# EAGLE design v1 (EAGLE 9.5.1)
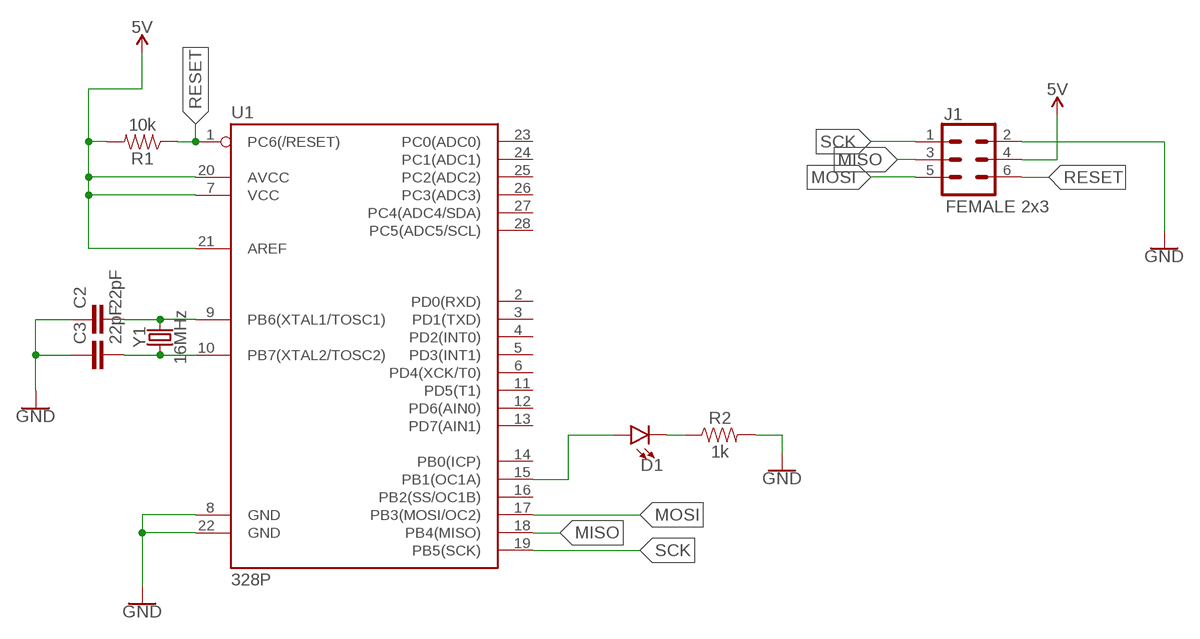
[diagram p0: schematic, sheet 1]

## Parts
C2  22pF  22PF-PTH-2.54MM-200V-5%  [CAP-PTH-2.54]
C3  22pF  22PF-PTH-2.54MM-200V-5%  [CAP-PTH-2.54]
D1  LED3MM  [LED_3MM]
J1  FEMALE 2x3  CONN_03X2FEMALE  [2X3]
R1  10k  1KOHM-HORIZ-1/4W-1%  [AXIAL-0.3]
R2  1k  1KOHM-HORIZ-1/4W-1%  [AXIAL-0.3]
U1  328P  ATMEGA328P_PDIP  [DIP28]
Y1  16MHz  CRYSTAL-16MHZPTH-HC49US  [HC49US]

## Nets
5V: J1.4 R1.P$2 U1.7(VCC) U1.20(AVCC) U1.21(AREF)
GND: C2.1 C3.1 J1.2 R2.P$2 U1.8(GND) U1.22(GND)
MISO: J1.3 U1.18(PB4(MISO))
MOSI: J1.5 U1.17(PB3(MOSI/OC2))
N$4: D1.A U1.15(PB1(OC1A))
N$5: D1.K(C) R2.P$1
N$6: C2.2 U1.9(PB6(XTAL1/TOSC1)) Y1.2
N$7: C3.2 U1.10(PB7(XTAL2/TOSC2)) Y1.1
RESET: J1.6 R1.P$1 U1.1(PC6(/RESET))
SCK: J1.1 U1.19(PB5(SCK))
Unconnected: U1.2(PD0(RXD)) U1.3(PD1(TXD)) U1.4(PD2(INT0)) U1.5(PD3(INT1)) U1.6(PD4(XCK/T0)) U1.11(PD5(T1)) U1.12(PD6(AIN0)) U1.13(PD7(AIN1)) U1.14(PB0(ICP)) U1.16(PB2(SS/OC1B)) U1.23(PC0(ADC0)) U1.24(PC1(ADC1)) U1.25(PC2(ADC2)) U1.26(PC3(ADC3)) U1.27(PC4(ADC4/SDA)) U1.28(PC5(ADC5/SCL))

## Library data of the parts
C2 C3 = SparkFun-Capacitors:22PF: 22pF ceramic capacitors A capacitor is a passive two-terminal electrical component used to store electrical energy temporarily in an electric field.; PROD_ID: CAP-09128
D1 = SparkFun-LED:LED: LED (Generic) Standard schematic elements and footprints for 5mm, 3mm, 1206, and 0603 sized LEDs. Generic LEDs with no color specified.; PROD_ID: DIO-08794
J1 = SparkFun-Connectors:CONN_03X2: Multi connection point. Often used as Generic Header-pin footprint for 0.1 inch spaced/style header connections You can populate with any combo of single row headers, but if you'd like an exact match, check these: Header - 2x3 (Male, 0.1") <https://www.sparkfun.com/products/12807> (PRT-12807) Header - 2x3 (Female, 0.1") <https://www.sparkfun.com/products/13010> (PRT-13010) 2x3 Pin Shrouded Header <https://www.sparkfun.com/products/10877> (PRT-10877) On any of the 0.1 inch spaced packages, you can populate with these: Break Away Headers - Straight <https://www.sparkfun.com/products/116> (PRT-00116) Break Away Male Headers - Right Angle <https://www.sparkfun.com/products/553> (PRT-00553) Female Headers <https://www.sparkfun.com/products/115> (PRT-00115) Break Away Headers - Machine Pin <https://www.sparkfun.com/products/117> (PRT-00117) Break Away Female Headers - Swiss Machine Pin <https://www.sparkfun.com/products/743> (PRT-00743) Special note: the shrouded connector mates well with our 3x2 ribbon cables: Ribbon Crimp Connector - 6-pin (2x3, Female) <https://www.sparkfun.com/products/10651> (PRT-10651) Ribbon Cable - 6 wire (15ft) <https://www.sparkfun.com/products/10646> (PRT-10646); PROD_ID: CONN-11566
R1 = SparkFun-Resistors:1KOHM: 1kΩ resistor A resistor is a passive two-terminal electrical component that implements electrical resistance as a circuit element. Resistors act to reduce current flow, and, at the same time, act to lower voltage levels within circuits. - Wikipedia; PROD_ID: RES-12182; VALUE: 1k
R2 = SparkFun-Resistors:1KOHM: 1kΩ resistor A resistor is a passive two-terminal electrical component that implements electrical resistance as a circuit element. Resistors act to reduce current flow, and, at the same time, act to lower voltage levels within circuits. - Wikipedia; PROD_ID: RES-12182
U1 = SparkFun-IC-Microcontroller:ATMEGA328P_PDIP: Atmel 328P Through hole ATMEGA328P uC used in the Arduino 32kb flash, 1k EEPROM, 2k SRAM Datasheet <http://www.sparkfun.com/datasheets/Components/SMD/ATMega328.pdf> SparkFun Products Storefront component: AVR 28 Pin 20MHz 32K 6A/D - ATMega328P <https://www.sparkfun.com/products/9061> (COM-09061) SparkFun Simon Says - Through-Hole Soldering Kit <https://www.sparkfun.com/products/10547> (KIT-10547) SparkFun Learn to Solder - Simon Says <https://www.sparkfun.com/products/13708> (KIT-13708) SparkFun BigTime Watch Kit <https://www.sparkfun.com/products/11734> (KIT-11734) SparkFun ClockIt <https://www.sparkfun.com/products/10930> (KIT-10930) SparkFun Serial Enabled LCD Kit <https://www.sparkfun.com/products/10097> (LCD-10097) SparkFun Simon Tilts - Through Hole Soldering Kit <https://www.sparkfun.com/products/12634> (KIT-12634) SparkFun Frequency Counter Kit <https://www.sparkfun.com/products/10140> (KIT-10140) FabFM Radio Kit <https://www.sparkfun.com/products/11043> (KIT-11043) SparkFun Binary Blaster Kit <https://www.sparkfun.com/products/12037> (KIT-12037) SparkFun Metro-Gnome <https://www.sparkfun.com/products/9236> (KIT-09236) ATmega328 with Arduino Optiboot (Uno) <https://www.sparkfun.com/products/10524> (DEV-10524); PROD_ID: IC-09136
Y1 = SparkFun-Clocks:CRYSTAL-16MHZ: 16MHz Crystal Digikey Example <http://www.digikey.com/product-search/en?keywords=535-9122-1-ND> Frequency: 16MHz Frequency Stability: ±50ppm Frequency Tolerance: ±20ppm Load Capacitance: 18pF SparkFun Products: Pro Micro -5V/16MHz <https://www.sparkfun.com/products/12640> SparkFun Serial Enabled LCD Kit <https://www.sparkfun.com/products/10097>; PROD_ID: XTAL-08181; SF_ID: COM-00536

## Board
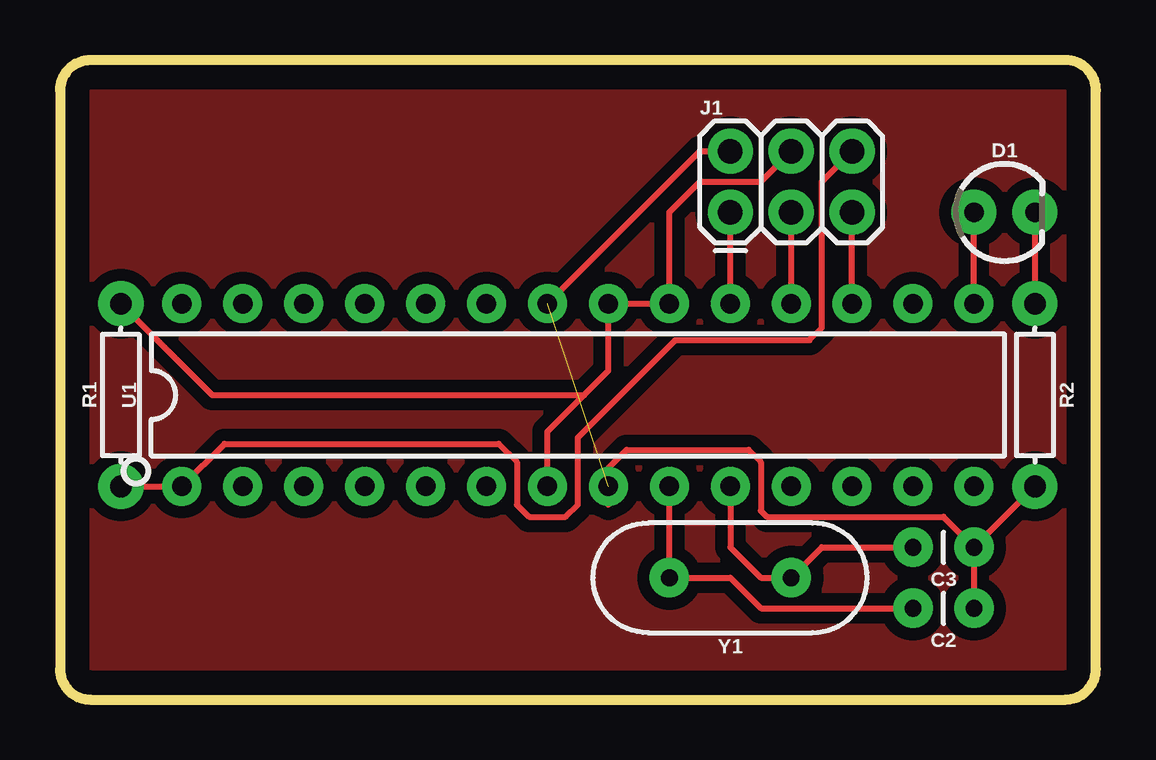
[diagram p1: board, top side]
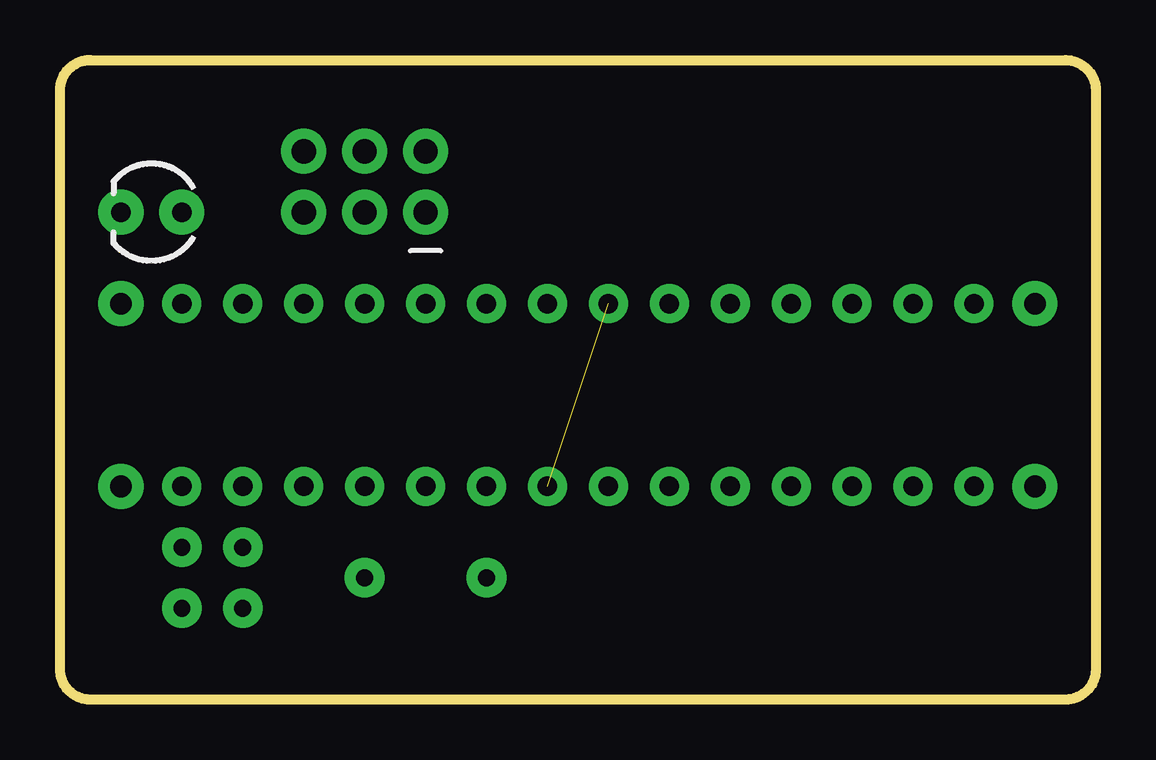
[diagram p2: board, bottom side, seen from below]

Size 43.18 x 26.67 mm. Coordinates in mm from the lower left corner, seen from the top.
Outline: 1.27,0 41.91,0 arc90 43.18,1.27 43.18,25.4 arc90 41.91,26.67 1.26,26.66 arc90 0,25.4 0,1.27 arc90 1.27,0
Copper layers (1*16): Top 0.035mm / dielectric 1.5mm / Bottom 0.035mm
Design rules "default": minimum track width 6mil, minimum drill 0.35mm, track to track 6mil, track to pad 6mil, pad to pad 6mil, via to via 6mil, smd to smd 6mil, copper to edge 40mil, drill to drill 6mil, minimum pad ring 10mil, minimum via ring 8mil, stop-mask expansion 4mil, vias tented up to drill 0mil, thermal gap 10mil

### Footprints (pad centres in the part's own frame; a part is rotated, then mirrored left to right if it is on the bottom)
CAP-PTH-2.54 = drill 0.7 pad 1.651: 1 -1.27,0; 2 1.27,0
LED_3MM = drill 0.813 pad 1.88: A -1.27,0; K 1.27,0
2X3 = drill 1.016 pad 1.88: 1 0,0; 2 0,2.54; 3 2.54,0; 4 2.54,2.54; 5 5.08,0; 6 5.08,2.54
AXIAL-0.3 = drill 0.9 pad 1.88: P$1 -3.81,0; P$2 3.81,0
DIP28 = drill 0.813 pad 1.626: 1 -16.51,-3.81; 2 -13.97,-3.81; 3 -11.43,-3.81; 4 -8.89,-3.81; 5 -6.35,-3.81; 6 -3.81,-3.81; 7 -1.27,-3.81; 8 1.27,-3.81; 9 3.81,-3.81; 10 6.35,-3.81; 11 8.89,-3.81; 12 11.43,-3.81; 13 13.97,-3.81; 14 16.51,-3.81; 15 16.51,3.81; 16 13.97,3.81; 17 11.43,3.81; 18 8.89,3.81; 19 6.35,3.81; 20 3.81,3.81; 21 1.27,3.81; 22 -1.27,3.81; 23 -3.81,3.81; 24 -6.35,3.81; 25 -8.89,3.81; 26 -11.43,3.81; 27 -13.97,3.81; 28 -16.51,3.81
HC49US = drill 0.7 pad 1.651: 1 -2.54,0; 2 2.54,0

### Placement (x,y rotation side)
C2  36.83,3.81 180 top
C3  36.83,6.35 180 top
D1  39.37,20.32 0 top
J1  27.94,20.32 0 top
R1  2.54,12.7 90 top
R2  40.64,12.7 270 top
U1  21.59,12.7 0 top
Y1  27.94,5.08 180 top

### Tracks (layer width: path | path; a pad name or v marks a point on that pad's centre or on a via)
5V
  Top 0.254: J1.4 29.21,21.59 26.67,21.59 25.4,20.32 U1.20 U1.21 22.86,13.72 21.84,12.7 | U1.7 20.32,11.18 21.84,12.7 | R1.P$2 6.35,12.7 21.84,12.7
GND  (1 unrouted)
  Top 0.254: C3.1 C2.1 | C3.1 R2.P$2 | U1.22 26.67,22.86 J1.2 | 22.86,8.13 U1.8 22.86,9.65 23.62,10.41 28.7,10.41 29.21,9.91 29.21,7.87 29.46,7.62 36.83,7.62 C3.1
MISO
  Top 0.254: U1.18 J1.3
MOSI
  Top 0.254: U1.17 J1.5
N$4
  Top 0.254: U1.15 D1.A
N$5
  Top 0.254: D1.K R2.P$1
N$6
  Top 0.254: U1.9 Y1.2 27.94,5.08 29.21,3.81 C2.2
N$7
  Top 0.254: U1.10 27.94,6.35 29.21,5.08 Y1.1 31.75,6.35 C3.2
NEW
  pour Top (isolate 0.508): 0,26.67 43.18,26.67 43.18,0 0,0
RESET
  Top 0.254: R1.P$1 U1.1 6.86,10.67 18.29,10.67 19.05,9.91 19.05,8.13 19.56,7.62 21.08,7.62 21.59,8.13 21.59,10.92 25.65,14.99 31.24,14.99 31.75,15.49 31.75,21.59 J1.6
SCK
  Top 0.254: U1.19 J1.1